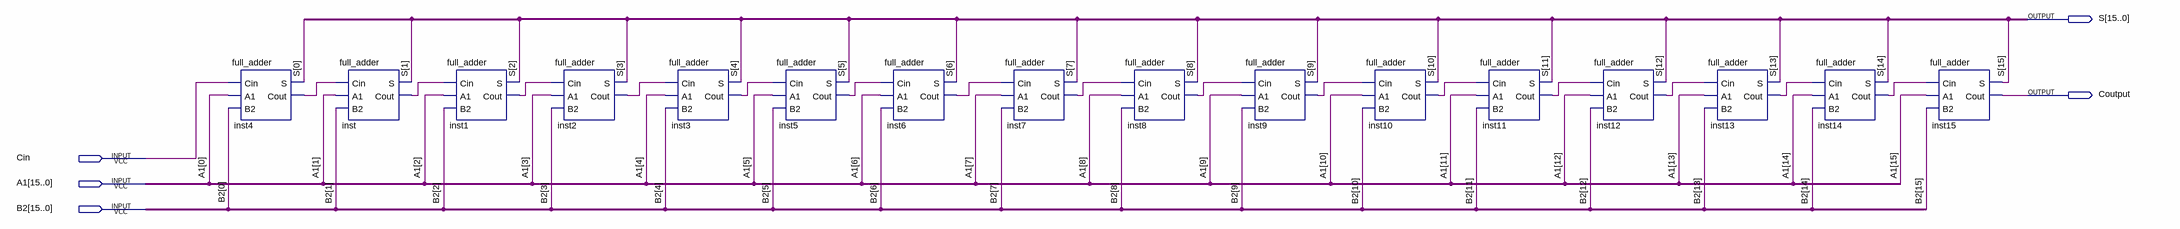
[diagram p0: schematic sheet]
// Quartus schematic half_adder_16.bdf as structural Verilog: 16 symbols, 5 pins
module half_adder_16 (
  input  Cin,
  input  [15:0] A1,
  input  [15:0] B2,
  output [15:0] S,
  output Coutput
);

  wire inst1_cout, inst2_cout, inst3_cout, inst4_cout, inst5_cout, inst6_cout, inst7_cout, inst8_cout,
       inst9_cout, inst10_cout, inst11_cout, inst12_cout, inst13_cout, inst14_cout, inst_cout;

  full_adder inst4 (.Cin(Cin), .A1(A1[0]), .B2(B2[0]), .S(S[0]), .Cout(inst4_cout));
  full_adder inst (.Cin(inst4_cout), .A1(A1[1]), .B2(B2[1]), .S(S[1]), .Cout(inst_cout));
  full_adder inst1 (.Cin(inst_cout), .A1(A1[2]), .B2(B2[2]), .S(S[2]), .Cout(inst1_cout));
  full_adder inst2 (.Cin(inst1_cout), .A1(A1[3]), .B2(B2[3]), .S(S[3]), .Cout(inst2_cout));
  full_adder inst3 (.Cin(inst2_cout), .A1(A1[4]), .B2(B2[4]), .S(S[4]), .Cout(inst3_cout));
  full_adder inst5 (.Cin(inst3_cout), .A1(A1[5]), .B2(B2[5]), .S(S[5]), .Cout(inst5_cout));
  full_adder inst6 (.Cin(inst5_cout), .A1(A1[6]), .B2(B2[6]), .S(S[6]), .Cout(inst6_cout));
  full_adder inst7 (.Cin(inst6_cout), .A1(A1[7]), .B2(B2[7]), .S(S[7]), .Cout(inst7_cout));
  full_adder inst8 (.Cin(inst7_cout), .A1(A1[8]), .B2(B2[8]), .S(S[8]), .Cout(inst8_cout));
  full_adder inst9 (.Cin(inst8_cout), .A1(A1[9]), .B2(B2[9]), .S(S[9]), .Cout(inst9_cout));
  full_adder inst10 (.Cin(inst9_cout), .A1(A1[10]), .B2(B2[10]), .S(S[10]), .Cout(inst10_cout));
  full_adder inst11 (.Cin(inst10_cout), .A1(A1[11]), .B2(B2[11]), .S(S[11]), .Cout(inst11_cout));
  full_adder inst12 (.Cin(inst11_cout), .A1(A1[12]), .B2(B2[12]), .S(S[12]), .Cout(inst12_cout));
  full_adder inst13 (.Cin(inst12_cout), .A1(A1[13]), .B2(B2[13]), .S(S[13]), .Cout(inst13_cout));
  full_adder inst14 (.Cin(inst13_cout), .A1(A1[14]), .B2(B2[14]), .S(S[14]), .Cout(inst14_cout));
  full_adder inst15 (.Cin(inst14_cout), .A1(A1[15]), .B2(B2[15]), .S(S[15]), .Cout(Coutput));
endmodule
